# Altium schematic sheet Isolated3V3.SCHDOC: Isolated 3V3 Power Supply
size A4; Organization: UNSW Solar Racing Team; Address3: UNSW; Address4: Sydney NSW 2052; Address2: Electrical Engineering; Address1: Rm 109
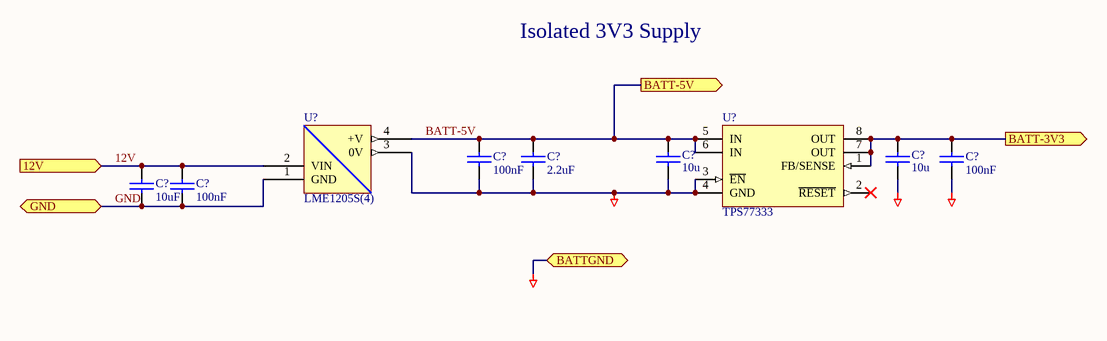
[diagram p0: Isolated3V3.SCHDOC]

## Parts
(Parts that share a designator on the sheet are numbered #1, #2 ... from top to bottom, then left to right.)
C?#1  100nF  [0603]
C?#2  2.2uF  [MCCT-CASEA]
C?#3  100nF  [0603]
C?#4  10u  [0805]
C?#5  10u  [0805]
C?#6  10uF  [MCCT-CASEB]
C?#7  100nF  [0603]
U?#1  LME1205S(4)  [NPSIP4]
U?#2  TPS77333  [MSOP8]

## Ports
12V (in), BATT-3V3 (out), BATT-5V (out), BATTGND (bidir), GND (bidir)

## Nets
BATTGND: C?#1.2 C?#2.2 C?#3.2 C?#4.1 C?#5.1 U?#1.3(0V) U?#2.3(~{EN}) U?#2.4(GND) ; port BATTGND
12V: C?#6.1 C?#7.1 U?#1.2(VIN) ; port 12V
BATT-3V3: C?#3.1 C?#5.2 U?#2.1(FB/SENSE) U?#2.7(OUT) U?#2.8(OUT) ; port BATT-3V3
BATT-5V: C?#1.1 C?#2.1 C?#4.2 U?#1.4(+V) U?#2.5(IN) U?#2.6(IN) ; port BATT-5V
GND: C?#6.2 C?#7.2 U?#1.1(GND) ; port GND

Not connected (* = marked no-connect by the designer): U?#2 2(~{RESET})*

## Notes on the sheet
- Isolated 3V3 Supply
- Title
- Size:
- Date:
- A4
- Number:
- Time:
- Revision:
- Sheet
- of
- File:

## Library data of the parts
C?#1 C?#2 C?#6 C?#7 = CAP: Capacitor
  C?#1 C?#7: Farnell: 753-567; Price: 0.31
  C?#2: Farnell: 967-099; Price: 0.938
  C?#6: Farnell: 967-117; Price: 1.28
C?#3 = CAP: Capacitor; Order#: 753-567; Price: 0.31; Supplier: Farnell
C?#4 C?#5 = CAP: Capacitor; Order#: 521-2820; Price: 0.489; Supplier: Farnell
U?#1 = LME0305S(4): isolated 250mW Single Output; Farnell: 1021405; Price: 42.90
U?#2 = TPS77350: Low-noise Positive Voltage Regulator; Order#: 296-8113-5-ND; Price: 1.750; Supplier: Digikey